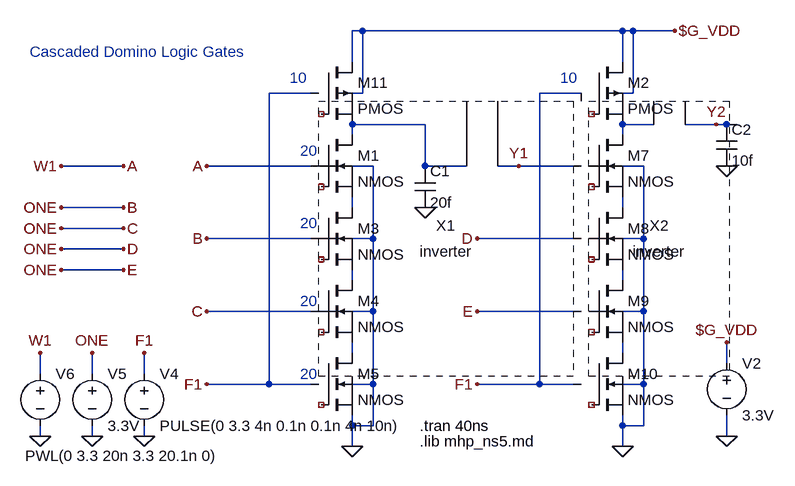
[diagram p0: schematic domino_cascade2.asc]
domino_cascade2.asc, the LTspice schematic file:
Version 4
SHEET 1 1292 680
WIRE -1584 -544 -1600 -544
WIRE -1184 -544 -1584 -544
WIRE -1168 -544 -1184 -544
WIRE -1104 -544 -1168 -544
WIRE -1600 -496 -1600 -544
WIRE -1184 -496 -1184 -544
WIRE -1664 -448 -1728 -448
WIRE -1584 -448 -1584 -544
WIRE -1584 -448 -1600 -448
WIRE -1248 -448 -1312 -448
WIRE -1168 -448 -1168 -544
WIRE -1168 -448 -1184 -448
WIRE -1488 -400 -1600 -400
WIRE -1136 -400 -1184 -400
WIRE -1040 -400 -1088 -400
WIRE -1024 -400 -1040 -400
WIRE -1008 -400 -1024 -400
WIRE -1600 -384 -1600 -400
WIRE -1184 -384 -1184 -400
WIRE -1952 -336 -2048 -336
WIRE -1664 -336 -1824 -336
WIRE -1568 -336 -1600 -336
WIRE -1488 -336 -1488 -400
WIRE -1424 -336 -1488 -336
WIRE -1344 -336 -1376 -336
WIRE -1248 -336 -1344 -336
WIRE -1152 -336 -1184 -336
WIRE -1952 -272 -2048 -272
WIRE -1600 -272 -1600 -288
WIRE -1184 -272 -1184 -288
WIRE -1952 -240 -2048 -240
WIRE -1664 -224 -1824 -224
WIRE -1568 -224 -1568 -336
WIRE -1568 -224 -1600 -224
WIRE -1248 -224 -1408 -224
WIRE -1152 -224 -1152 -336
WIRE -1152 -224 -1184 -224
WIRE -1952 -208 -2048 -208
WIRE -1952 -176 -2048 -176
WIRE -1600 -160 -1600 -176
WIRE -1184 -160 -1184 -176
WIRE -1664 -112 -1824 -112
WIRE -1568 -112 -1568 -224
WIRE -1568 -112 -1600 -112
WIRE -1248 -112 -1408 -112
WIRE -1152 -112 -1152 -224
WIRE -1152 -112 -1184 -112
WIRE -1600 -48 -1600 -64
WIRE -1184 -48 -1184 -64
WIRE -1024 -32 -1024 -64
WIRE -2080 -16 -2080 -48
WIRE -2000 -16 -2000 -48
WIRE -1920 -16 -1920 -48
WIRE -1728 0 -1728 -448
WIRE -1728 0 -1824 0
WIRE -1664 0 -1728 0
WIRE -1568 0 -1568 -112
WIRE -1568 0 -1600 0
WIRE -1312 0 -1312 -448
WIRE -1312 0 -1408 0
WIRE -1248 0 -1312 0
WIRE -1152 0 -1152 -112
WIRE -1152 0 -1184 0
WIRE -1600 64 -1600 48
WIRE -1568 64 -1568 0
WIRE -1568 64 -1600 64
WIRE -1184 64 -1184 48
WIRE -1152 64 -1152 0
WIRE -1152 64 -1184 64
WIRE -2080 80 -2080 64
WIRE -2000 80 -2000 64
WIRE -1920 80 -1920 64
WIRE -1024 80 -1024 48
WIRE -1600 96 -1600 64
WIRE -1184 96 -1184 64
FLAG -1184 96 0
FLAG -1408 0 F1
FLAG -1600 96 0
FLAG -1824 0 F1
FLAG -1024 80 0
FLAG -1024 -64 $G_VDD
FLAG -1104 -544 $G_VDD
FLAG -1824 -336 A
FLAG -1824 -224 B
FLAG -1824 -112 C
FLAG -1408 -224 D
FLAG -1408 -112 E
FLAG -1040 -400 Y2
FLAG -1344 -336 Y1
FLAG -1920 80 0
FLAG -1920 -48 F1
FLAG -2000 80 0
FLAG -2000 -48 ONE
FLAG -2080 80 0
FLAG -2080 -48 W1
FLAG -1488 -272 0
FLAG -1024 -336 0
FLAG -1952 -272 B
FLAG -1952 -240 C
FLAG -2048 -240 ONE
FLAG -2048 -272 ONE
FLAG -2048 -336 W1
FLAG -1952 -336 A
FLAG -1952 -208 D
FLAG -2048 -208 ONE
FLAG -1952 -176 E
FLAG -2048 -176 ONE
SYMBOL pmos -1232 -496 R0
SYMATTR InstName M2
SYMATTR Value2 l=0.6u w=3u
SYMBOL pmos -1648 -496 R0
SYMATTR InstName M11
SYMATTR Value2 l=0.6u w=3u
SYMBOL voltage -1024 -48 R0
WINDOW 123 0 0 Left 2
WINDOW 39 0 0 Left 2
SYMATTR InstName V2
SYMATTR Value 3.3V
SYMBOL nmos -1648 -384 R0
SYMATTR InstName M1
SYMATTR SpiceModel ""
SYMATTR Value NMOS
SYMATTR Value2 l=0.6u w=6u
SYMBOL nmos -1648 -272 R0
SYMATTR InstName M3
SYMATTR SpiceModel ""
SYMATTR Value NMOS
SYMATTR Value2 l=0.6u w=6u
SYMBOL nmos -1648 -160 R0
SYMATTR InstName M4
SYMATTR SpiceModel ""
SYMATTR Value NMOS
SYMATTR Value2 l=0.6u w=6u
SYMBOL nmos -1648 -48 R0
SYMATTR InstName M5
SYMATTR SpiceModel ""
SYMATTR Value NMOS
SYMATTR Value2 l=0.6u w=6u
SYMBOL nmos -1232 -384 R0
SYMATTR InstName M7
SYMATTR SpiceModel ""
SYMATTR Value NMOS
SYMATTR Value2 l=0.6u w=6u
SYMBOL nmos -1232 -272 R0
SYMATTR InstName M8
SYMATTR SpiceModel ""
SYMATTR Value NMOS
SYMATTR Value2 l=0.6u w=6u
SYMBOL nmos -1232 -160 R0
SYMATTR InstName M9
SYMATTR SpiceModel ""
SYMATTR Value NMOS
SYMATTR Value2 l=0.6u w=6u
SYMBOL nmos -1232 -48 R0
SYMATTR InstName M10
SYMATTR SpiceModel ""
SYMATTR Value NMOS
SYMATTR Value2 l=0.6u w=6u
SYMBOL inverter -1408 -336 R0
SYMATTR InstName X1
SYMBOL inverter -1120 -400 R0
SYMATTR InstName X2
SYMBOL voltage -1920 -32 R0
WINDOW 123 0 0 Left 2
WINDOW 39 0 0 Left 2
SYMATTR InstName V4
SYMATTR Value PULSE(0 3.3 4n 0.1n 0.1n 4n 10n)
SYMBOL voltage -2000 -32 R0
WINDOW 123 0 0 Left 2
WINDOW 39 0 0 Left 2
SYMATTR InstName V5
SYMATTR Value 3.3V
SYMBOL voltage -2080 -32 R0
WINDOW 123 0 0 Left 2
WINDOW 39 0 0 Left 2
WINDOW 3 -23 142 Left 2
SYMATTR InstName V6
SYMATTR Value PWL(0 3.3 20n 3.3 20.1n 0)
SYMBOL cap -1504 -336 R0
SYMATTR InstName C1
SYMATTR Value 20f
SYMBOL cap -1040 -400 R0
SYMATTR InstName C2
SYMATTR Value 10f
TEXT -1280 -472 Left 2 ;10
TEXT -1696 -472 Left 2 ;10
TEXT -1496 88 Left 2 !.lib mhp_ns5.md
TEXT -1496 64 Left 2 !.tran 40ns
TEXT -2096 -512 Left 2 ;Cascaded Domino Logic Gates
TEXT -1680 -360 Left 2 ;20
TEXT -1680 -248 Left 2 ;20
TEXT -1680 -128 Left 2 ;20
TEXT -1680 -16 Left 2 ;20

The netlist it stands for:
* domino_cascade2.asc
M2 $G_VDD NC_01 N002 N002 PMOS l=0.6u w=3u
M11 $G_VDD NC_02 N001 N001 PMOS l=0.6u w=3u
V2 $G_VDD 0 3.3V
M1 N001 NC_03 N003 N003 NMOS l=0.6u w=6u
M3 N003 NC_04 N005 N005 NMOS l=0.6u w=6u
M4 N005 NC_05 N007 N007 NMOS l=0.6u w=6u
M5 N007 NC_06 0 0 NMOS l=0.6u w=6u
M7 N002 NC_07 N004 N004 NMOS l=0.6u w=6u
M8 N004 NC_08 N006 N006 NMOS l=0.6u w=6u
M9 N006 NC_09 N008 N008 NMOS l=0.6u w=6u
M10 N008 NC_10 0 0 NMOS l=0.6u w=6u
* X1: inverter (symbol inverter not available, pin order unknown); nets seen at it: $G_VDD, 0, F1, N001, ONE, W1, Y1
* X2: inverter (symbol inverter not available, pin order unknown); nets seen at it: $G_VDD, 0, F1, N002, Y2
V4 F1 0 PULSE(0 3.3 4n 0.1n 0.1n 4n 10n)
V5 ONE 0 3.3V
V6 W1 0 PWL(0 3.3 20n 3.3 20.1n 0)
C1 N001 0 20f
C2 Y2 0 10f
.model NMOS NMOS
.model PMOS PMOS
.lib standard.mos
* 10
* 10
.lib mhp_ns5.md
.tran 40ns
* Cascaded Domino Logic Gates
* 20
* 20
* 20
* 20
.backanno
.end